# EAGLE design schema_8 (EAGLE 9.1.0)
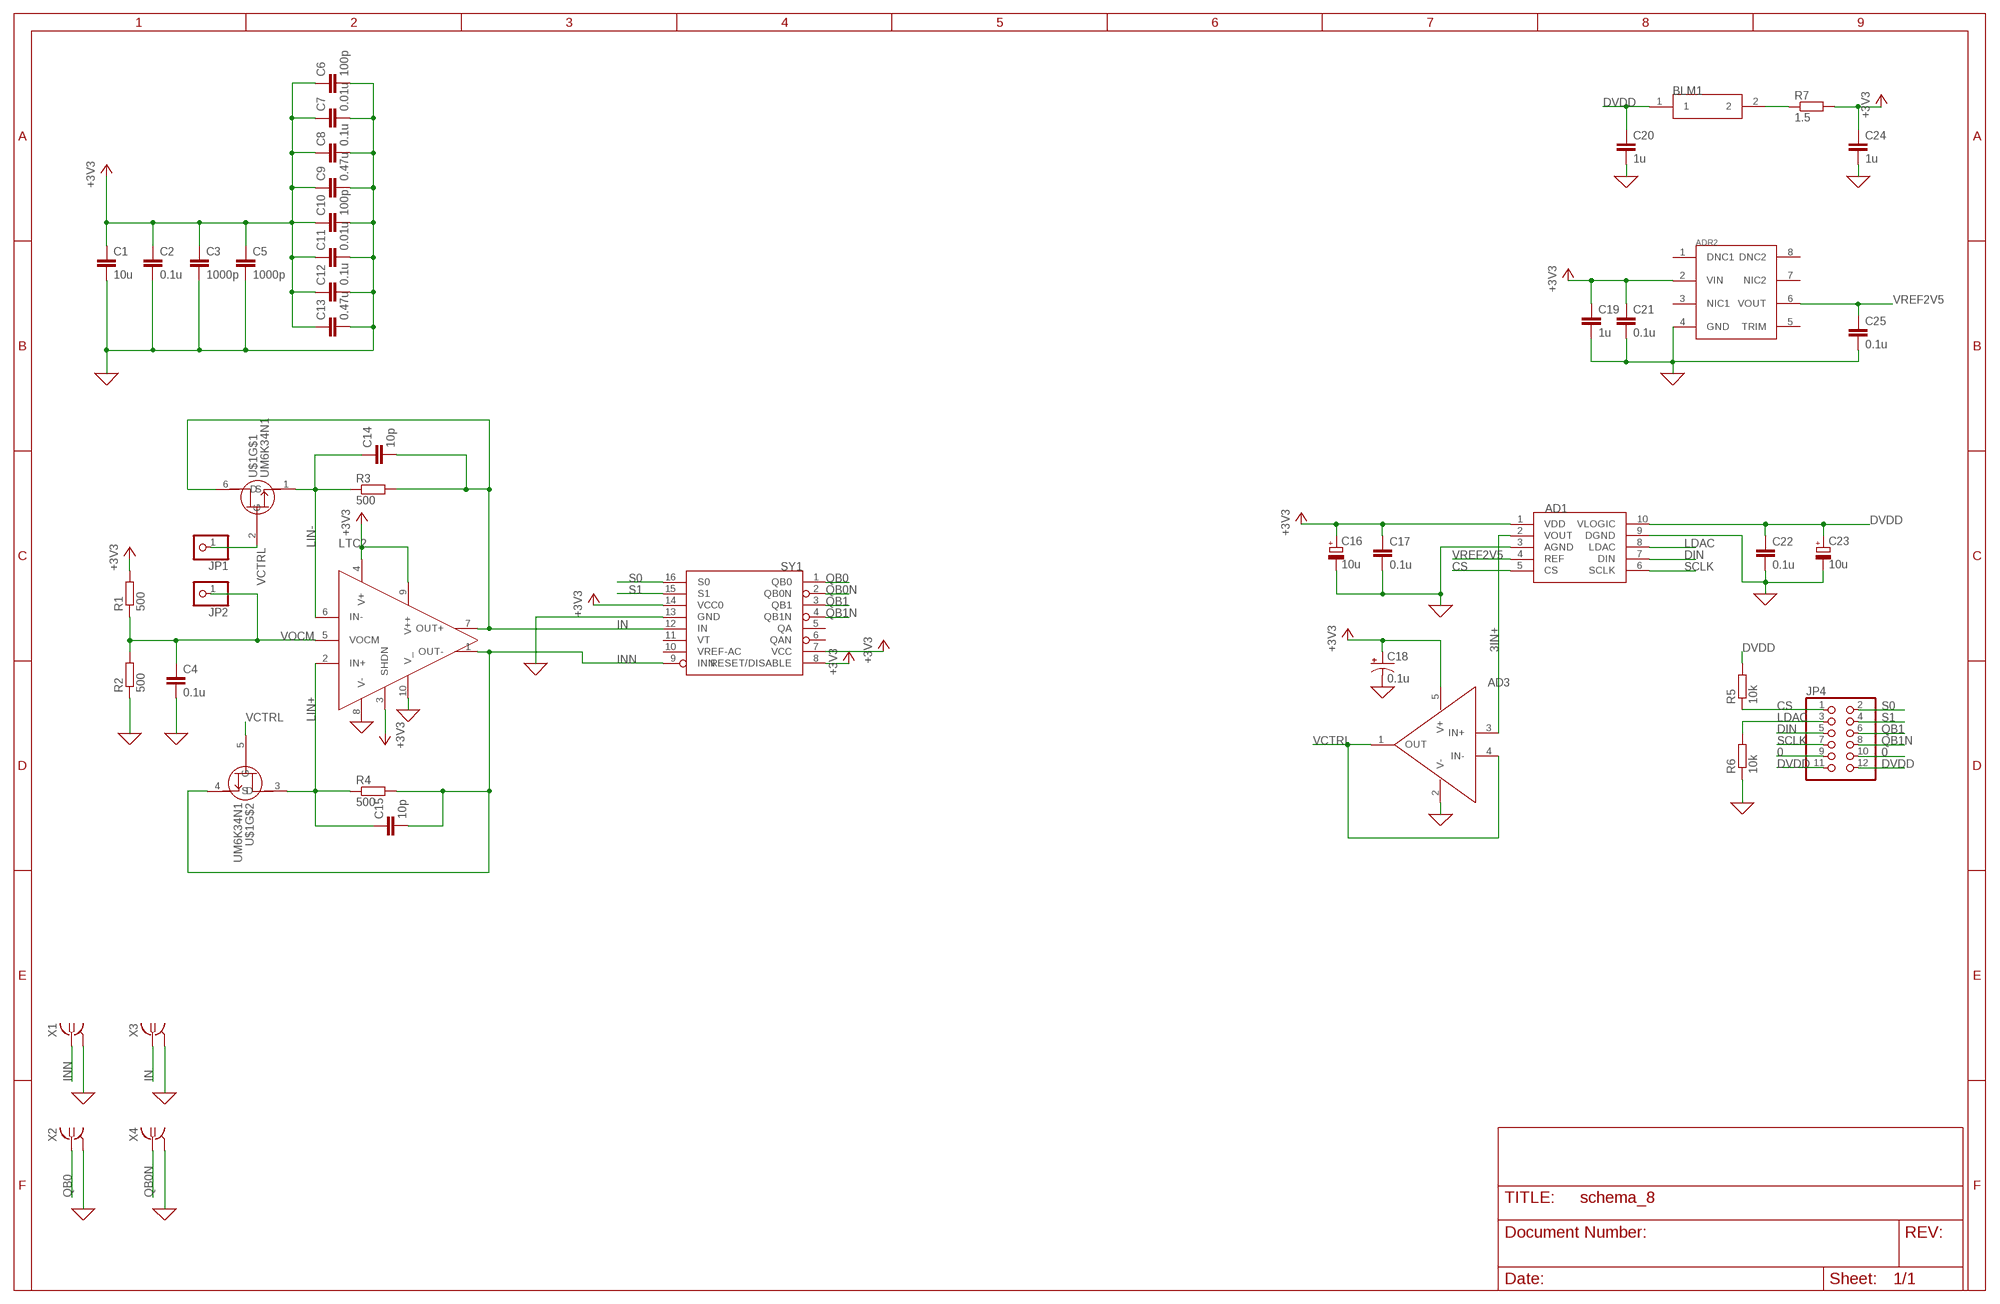
[diagram p0: schematic, sheet 1]

## Parts
AD1  0  AD5541AN  [SOP50P490X110-10]
AD3  0  AD8605N  [SOT95P280X145-5]
ADR2  ADR441N  [SOIC127P600X175-8]
BLM1  0  BLM18EG221TN1D  [C1608]
C1  10u  C-EUC1210  [C1210]
C2  0.1u  C-EUC0603  [C0603]
C3  1000p  C-EUC1206  [C1206]
C4  0.1u  C-EUC0603  [C0603]
C5  1000p  C-EUC1206  [C1206]
C6  100p  C-EUC0805  [C0805]
C7  0.01u  C-EUC1808  [C1808]
C8  0.1u  C-EUC0603  [C0603]
C9  0.47u  C-EUC1210  [C1210]
C10  100p  C-EUC0805  [C0805]
C11  0.01u  C-EUC1808  [C1808]
C12  0.1u  C-EUC0603  [C0603]
C13  0.47u  C-EUC1210  [C1210]
C14  10p  C-EUC0603  [C0603]
C15  10p  C-EUC0603  [C0603]
C16  10u  CPOL-EU153CLV-0405  [153CLV-0405]
C17  0.1u  C-EUC0603  [C0603]
C18  0.1u  CPOL-US153CLV-0405  [153CLV-0405]
C19  1u  C-EUC0603  [C0603]
C20  1u  C-EUC0603  [C0603]
C21  0.1u  C-EUC0603  [C0603]
C22  0.1u  C-EUC0603  [C0603]
C23  10u  CPOL-EU153CLV-0405  [153CLV-0405]
C24  1u  C-EUC0603  [C0603]
C25  0.1u  C-EUC0603  [C0603]
JP1  0  PINHD-1X1  [1X01]
JP2  0  PINHD-1X1  [1X01]
JP4  0  PINHD-2X6/90  [2X06/90]
LTC2  0  LTC6409N  [QFN50P350X250X80-10]
R1  500  R-EU_R0603  [R0603]
R2  500  R-EU_R0603  [R0603]
R3  500  R-EU_R0603  [R0603]
R4  500  R-EU_R0603  [R0603]
R5  10k  R-EU_R0805  [R0805]
R6  10k  R-EU_R0805  [R0805]
R7  1.5  R-EU_R0805  [R0805]
SY1  SY89873LN  [QFN50P300X300X90-16]
U$1  UM6K34N1  [SOTFL65P210X100-6]
X1  SMA-142-0701-871/880  [SMA-142-0701-871]
X2  SMA-142-0701-871/880  [SMA-142-0701-871]
X3  SMA-142-0701-871/880  [SMA-142-0701-871]
X4  SMA-142-0701-871/880  [SMA-142-0701-871]

## Nets
0: AD1.3(AGND) AD1.9(DGND) AD3.2(V-) ADR2.4(GND) C1.2 C2.2 C3.2 C4.2 C5.2 C6.2 C7.2 C8.2 C9.2 C10.2 C11.2 C12.2 C13.2 C16.- C17.2 C18.- C19.2 C20.2 C21.2 C22.2 C23.- C24.2 C25.2 JP4.9 JP4.10 LTC2.8(V-) LTC2.10(V_) R2.1 R6.1 SY1.13(GND) X1.2@1 X1.2@2 X1.2@3 X1.2@4 X2.2@1 X2.2@2 X2.2@3 X2.2@4 X3.2@1 X3.2@2 X3.2@3 X3.2@4 X4.2@1 X4.2@2 X4.2@3 X4.2@4 ; supply symbol labelled GND
3IN+: AD1.2(VOUT) AD3.3(IN+)
+3V3: AD1.1(VDD) AD3.5(V+) ADR2.2(VIN) C1.1 C2.1 C3.1 C5.1 C6.1 C7.1 C8.1 C9.1 C10.1 C11.1 C12.1 C13.1 C16.+ C17.1 C18.+ C19.1 C21.1 C24.1 LTC2.3(SHDN) LTC2.4(V+) LTC2.9(V++) R1.2 R7.2 SY1.7(VCC) SY1.8(RESET/DISABLE) SY1.14(VCC0)
CS: AD1.5(CS) JP4.1 R5.1
DIN: AD1.7(DIN) JP4.5
DVDD: AD1.10(VLOGIC) BLM1.1 C20.1 C22.1 C23.+ JP4.11 JP4.12 R5.2
IN: C14.2 LTC2.7(OUT+) R3.2 SY1.12(IN) U$1.6(D) X3.1
INN: C15.2 LTC2.1(OUT-) R4.2 SY1.9(INN) U$1.4(S) X1.1
LDAC: AD1.8(LDAC) JP4.3 R6.2
LIN+: C15.1 LTC2.2(IN+) R4.1 U$1.3(D)
LIN-: C14.1 LTC2.6(IN-) R3.1 U$1.1(S)
N$7: BLM1.2 R7.1
QB0: SY1.1(QB0) X2.1
QB0N: SY1.2(QB0N) X4.1
QB1: JP4.6 SY1.3(QB1)
QB1N: JP4.8 SY1.4(QB1N)
S0: JP4.2 SY1.16(S0)
S1: JP4.4 SY1.15(S1)
SCLK: AD1.6(SCLK) JP4.7
VCTRL: AD3.1(OUT) AD3.4(IN-) JP1.1 U$1.2(G) U$1.5(G)
VOCM: C4.1 JP2.1 LTC2.5(VOCM) R1.1 R2.2
VREF2V5: AD1.4(REF) ADR2.6(VOUT) C25.1
Unconnected: ADR2.1(DNC1) ADR2.3(NIC1) ADR2.5(TRIM) ADR2.7(NIC2) ADR2.8(DNC2) SY1.5(QA) SY1.6(QAN) SY1.10(VREF-AC) SY1.11(VT)

## Library data of the parts
AD1 = mylibrary:AD5541A
AD3 = mylibrary:AD8605
ADR2 = mylibrary:ADR441
BLM1 = mylibrary:BLM18EG221TN1D: https://www.tme.eu/en/details/blm18eg221tn1d/ferrite-beads/murata/
C1-C3 C5-C13 = rcl:C-EU: CAPACITOR, European symbol
C4 C14 C15 C17 C19-C22 C24 C25 = rcl:C-EU: CAPACITOR, European symbol; SPICEPREFIX: C
C16 C23 = resistor:CPOL-EU: POLARIZED CAPACITOR, European symbol
C18 = rcl:CPOL-US: POLARIZED CAPACITOR, American symbol; SPICEPREFIX: C
JP1 JP2 = pinhead:PINHD-1X1: PIN HEADER
JP4 = pinhead:PINHD-2X6: PIN HEADER
LTC2 = mylibrary:LTC6409
R1 R2 R5-R7 = rcl:R-EU_: RESISTOR, European symbol; SPICEPREFIX: R
R3 R4 = resistor:R-EU_: RESISTOR, European symbol
SY1 = mylibrary:SY89873L
U$1 = mylibrary:UM6K34N1
X1-X4 = con-coax:SMA-: SMA 50 Ohm End Launch Jack Receptacle - Round Contact Johnson Components Source: www.johnsoncomponents.com .. J502-ND.pdf; MF: JOHNSON COMPONENTS; MPN: 142-0701-871; OC_FARNELL: 1339835; OC_NEWARK: 91B6105

## Board
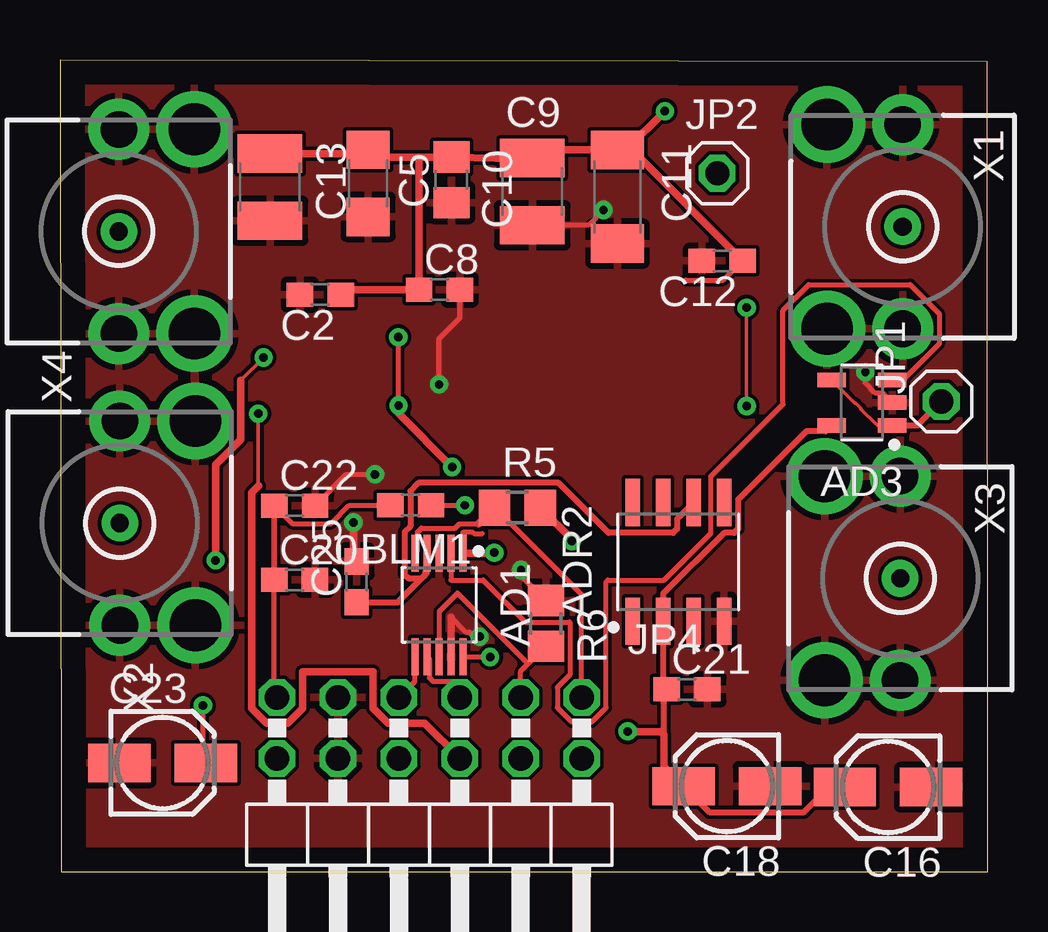
[diagram p1: board, top side]
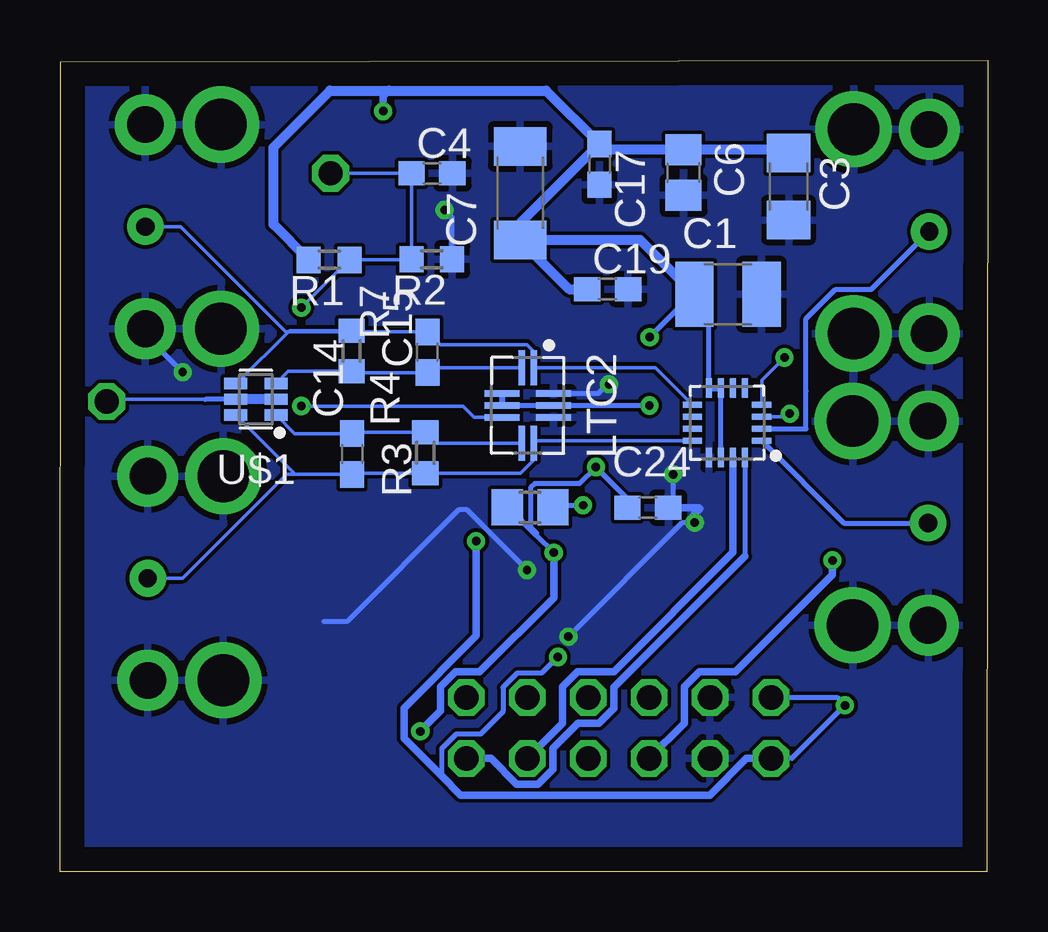
[diagram p2: board, bottom side, seen from below]

Size 38.69 x 33.83 mm. Coordinates in mm from the lower left corner, seen from the top.
Outline: 0.04,0 38.69,0 38.65,33.77 0,33.83 0.04,0
Copper layers (1*16): Top 0.035mm / dielectric 1.5mm / Bottom 0.035mm
Design rules "default": minimum track width 6mil, minimum drill 0.35mm, track to track 6mil, track to pad 6mil, pad to pad 6mil, via to via 6mil, smd to smd 6mil, copper to edge 40mil, drill to drill 6mil, minimum pad ring 10mil, minimum via ring 8mil, stop-mask expansion 4mil, vias tented up to drill 0mil, thermal gap 10mil

### Footprints (pad centres in the part's own frame; a part is rotated, then mirrored left to right if it is on the bottom)
SOP50P490X110-10 = smd 1.55 x 0.297: 1 -2.156,1; 2 -2.156,0.5; 3 -2.156,0; 4 -2.156,-0.5; 5 -2.156,-1; 6 2.156,-1; 7 2.156,-0.5; 8 2.156,0; 9 2.156,0.5; 10 2.156,1
SOT95P280X145-5 = smd 1.186 x 0.597: 1 -1.264,0.95; 2 -1.264,0; 3 -1.264,-0.95; 4 1.264,-0.95; 5 1.264,0.95
SOIC127P600X175-8 = smd 1.968 x 0.599: 1 -2.473,1.905; 2 -2.473,0.635; 3 -2.473,-0.635; 4 -2.473,-1.905; 5 2.473,-1.905; 6 2.473,-0.635; 7 2.473,0.635; 8 2.473,1.905
C1608 = smd 1.1 x 1: 1 -0.85,0; 2 0.85,0
C1210 = smd 1.6 x 2.7: 1 -1.4,0; 2 1.4,0
C0603 = smd 1.1 x 1: 1 -0.85,0; 2 0.85,0
C1206 = smd 1.6 x 1.8: 1 -1.4,0; 2 1.4,0
C0805 = smd 1.3 x 1.5: 1 -0.95,0; 2 0.95,0
C1808 = smd 1.6 x 2.2: 1 -1.95,0; 2 1.95,0
153CLV-0405 = smd 2.6 x 1.6: + 1.8,0; - -1.8,0
1X01 = drill 1.016 octagon: 1 0,0
2X06/90 = drill 1.016 octagon: 1 -6.35,-6.35; 2 -6.35,-3.81; 3 -3.81,-6.35; 4 -3.81,-3.81; 5 -1.27,-6.35; 6 -1.27,-3.81; 7 1.27,-6.35; 8 1.27,-3.81; 9 3.81,-6.35; 10 3.81,-3.81; 11 6.35,-6.35; 12 6.35,-3.81
QFN50P350X250X80-10 = smd 1.459 x 0.27: 1 -1.574,0.25; 2 -1.574,-0.25; 6 1.574,-0.25; 7 1.574,0.25 | smd 0.27 x 1.459: 3 -0.5,-1.074; 4 0,-1.074; 5 0.5,-1.074; 8 0.5,1.074; 9 0,1.074; 10 -0.5,1.074
R0603 = smd 1 x 1.1: 1 -0.85,0; 2 0.85,0
R0805 = smd 1.3 x 1.5: 1 -0.95,0; 2 0.95,0
QFN50P300X300X90-16 = smd 0.81 x 0.25: 1 -1.445,0.75; 2 -1.445,0.25; 3 -1.445,-0.25; 4 -1.445,-0.75; 9 1.445,-0.75; 10 1.445,-0.25; 11 1.445,0.25; 12 1.445,0.75 | smd 0.25 x 0.81: 5 -0.75,-1.445; 6 -0.25,-1.445; 7 0.25,-1.445; 8 0.75,-1.445; 13 0.75,1.445; 14 0.25,1.445; 15 -0.25,1.445; 16 -0.75,1.445
SOTFL65P210X100-6 = smd 0.956 x 0.472: 1 -0.836,0.65; 2 -0.836,0; 3 -0.836,-0.65; 4 0.836,-0.65; 5 0.836,0; 6 0.836,0.65
SMA-142-0701-871 = drill 0.762 pad 1.524: 1 0,0 | drill 1.524 pad 2.54: 2@1 -4.255,0; 2@2 4.255,0 | drill 2.159 pad 2.794: 2@3 -4.255,-3.15; 2@4 4.255,-3.15

### Placement (x,y rotation side)
AD1  15.8,11.13 270 top
AD3  33.43,19.55 180 top
ADR2  25.78,12.92 90 top
BLM1  14.62,15.28 0 top
C1  10.84,24.07 0 bottom
C2  10.85,24.06 180 top
C3  8.31,28.56 270 bottom
C4  23.18,29.1 0 bottom
C5  12.84,28.69 270 top
C6  12.7,29.14 270 bottom
C7  19.5,28.28 90 bottom
C8  15.82,24.27 0 top
C9  19.69,28.35 270 top
C10  16.31,28.84 270 top
C11  23.24,28.13 270 top
C12  27.61,25.46 180 top
C13  8.75,28.53 270 top
C14  26.5,17.41 270 bottom
C15  23.36,21.65 90 bottom
C16  34.52,3.53 180 top
C17  16.2,29.48 270 bottom
C18  27.8,3.57 180 top
C19  15.86,24.29 0 bottom
C20  9.78,12.17 0 top
C21  26.14,7.6 0 top
C22  9.79,15.27 0 top
C23  4.28,4.55 0 top
C24  14.18,15.18 0 bottom
C25  12.37,12.09 90 top
JP1  36.74,19.6 270 top
JP2  27.4,29.11 0 top
JP4  15.4,0.92 180 top
LTC2  19.19,19.44 270 bottom
R1  27.46,25.5 180 bottom
R2  23.18,25.53 180 bottom
R3  23.46,17.46 270 bottom
R4  26.53,21.71 90 bottom
R5  19.07,15.18 0 top
R6  20.25,10.36 270 top
R7  19.09,15.19 180 bottom
SY1  10.88,18.71 180 bottom
U$1  30.52,19.69 180 bottom
X1  35.13,26.88 270 top
X2  2.49,14.53 90 top
X3  35.03,12.24 270 top
X4  2.45,26.69 90 top

### Tracks (layer width: path | path; a pad name or v marks a point on that pad's centre or on a via)
0  (via drill 0.35)
  Top 0.2: R6.1 19.22,12.34 v19.22,12.58 | v15.8,20.32 15.8,22.21 16.67,23.08 C8.2 | 16.3,10.6 16.91,10 17.05,10 17.25,9.8 v17.49,9.8 | C22.2 11.93,16.56 v13.13,16.56 | AD3.2 34.3,19.95 34,19.95 33.57,20.38 v33.57,20.82 | v22.66,27.58 22.02,26.95 C9.2
  Top 0.305: AD1.9 16.3,10.6 | v12.23,14.56 12.23,13.08 C25.2
  Bottom 0.2: v19.22,12.58 21.72,15.08 22.07,15.08 26.72,10.43 27.69,10.43 | LTC2.10 16.25,19.94 15.87,20.32 v15.8,20.32 | v17.49,9.8 12.74,14.56 v12.23,14.56 | v13.13,16.56 13.13,15.38 C24.2 | v33.57,20.82 35.13,22.38 X1.2@2 | R2.1 22.33,27.26 v22.66,27.58
  Bottom 0.305: C24.2 12.05,15.18 12.01,15.14 12.23,14.92 v12.23,14.56
  pour Top: 0.38,33.57 38.35,33.57 38.42,33.64 38.42,0.4 38.33,0.31 0.46,0.31 0.36,0.41 0.36,33.57 0.36,33.57
  pour Bottom: 0.42,33.62 38.47,33.62 38.52,33.57 38.52,0.19 38.53,0.19 0.18,0.19 0.18,33.62 0.23,33.66
3IN+
  Top 0.2: AD1.2 16.3,12.16 17.64,12.16 19.4,10.4 21.25,10.4 21.25,8.21 20.73,7.69 20.73,6.85 21.33,6.25 22.17,6.25 22.76,6.85 22.76,12.08 22.84,12.16 25.19,12.16 27.13,14.1 27.13,16.48 30.14,19.48 30.14,23.39 31.21,24.47 35.44,24.47 36.65,23.26 36.65,22 35.15,20.5 AD3.3
+3V3  (via drill 0.35)
  Top 0.2: v14.12,19.44 14.12,22.17 14.11,22.18 v14.11,22.28 | AD1.1 16.8,14.15 17.22,14.15 17.27,14.1 17.61,14.1 | 26.08,24.66 27.65,24.66 C12.1
  Top 0.254: 25.19,7.7 25.14,7.75 ADR2.2 25.14,11.58 27.69,14.13 28.1,14.13 28.26,14.29 28.26,15.52 31.1,18.36 31.92,18.36 AD3.5 | 25.19,7.7 C21.1 | 25.19,5.71 25.19,7.7 | C16.+ 32.06,3.53 31.01,2.49 27.08,2.49 C18.+
  Top 0.305: C13.1 12.68,29.93 C5.1 13.15,29.79 14.84,29.79 | 14.84,29.79 C10.1 18.17,29.75 C9.1 20.02,30.08 C11.1 23.6,30.08 | 14.84,29.79 14.97,29.66 C8.1 11.91,24.27 C2.1 | 23.6,30.08 23.84,30.08 C12.1 28.24,25.46 | C18.+ 25.19,4.38 25.19,5.71 25.05,5.85 v23.68,5.85 v23.67,5.85 | v25.21,31.7 23.6,30.08 | AD1.1 18.05,13.28 18.09,13.32 v18.1,13.3 | v16.35,16.87 14.12,19.1 v14.12,19.44
  Bottom 0.2: SY1.8 11.63,23.46 C1.1 12.32,24.07 v14.11,22.28 | SY1.14 SY1.7 | LTC2.4 LTC2.9 v14.12,19.44 14.11,19.45 | C24.1 15.03,15.55 v16.35,16.87 17.03,16.19 18.89,16.19 19.04,16.04 19.04,14.33 18.82,14.11 18.82,14.02 | v18.1,13.3 18.82,14.02 | 18.82,14.02 19.99,15.19 R7.2
  Bottom 0.254: SY1.8 SY1.7 | LTC2.3 LTC2.4
  Bottom 0.305: v18.1,13.3 18.1,11.42 21.19,8.34 22.19,8.34 22.81,7.71 22.81,6.71 v23.67,5.85 | 24.98,32.55 25.21,32.32 v25.21,31.7 25.21,31.68
  Bottom 0.406: C3.1 8.44,30.09 C6.1 15.96,30.09 C17.1 | C17.1 19.5,27.03 C7.1 | C7.1 17.46,24.29 C19.1 | C1.1 14.5,26.33 C7.1 | R1.2 29.79,26.98 29.79,30.19 27.43,32.55 24.98,32.55 18.42,32.55 C17.1
CS
  Top 0.2: R5.1 18.8,14.5 21.09,12.21 21.11,12.21 21.75,11.57 JP4.1 | AD1.5 14.9,13.38 14.9,14.16 15.07,14.33 16.47,14.33 16.65,14.5 17.44,14.5
  Top 0.305: 17.44,14.5 R5.1
DIN
  Top 0.2: JP4.5 16.67,7.6 16.33,7.94 15.55,7.94 15.4,8.09 15.4,8.87 AD1.7
DVDD  (via drill 0.35)
  Top 0.2: 8.94,15.03 C22.1 9.69,14.51 11.29,14.51 12.05,15.28 BLM1.1 | 8.94,15.03 C20.1 | JP4.11 8.94,7.38 8.94,15.03 | C23.+ 5.96,4.66 v5.96,6.94 | AD1.10 17.95,8.97 17.97,8.95 17.94,8.95 v17.93,8.96
  Top 0.305: R5.2 21.41,13.79 21.41,13.78 v21.34,13.78
  Bottom 0.2: JP4.12 8.17,4.73 v5.96,6.94 6.29,7.27 JP4.11 | v17.93,8.96 18.61,8.28 19.63,8.28 20.22,7.69 20.22,6.67 21.15,5.74 22.17,5.74 22.78,5.13 22.78,4
  Bottom 0.305: JP4.12 10.08,4.73 11.6,3.2 21.98,3.2 22.78,4 24.35,5.57 24.35,6.82 21.34,9.83 v21.34,13.78
IN
  Bottom 0.152: SY1.12 18.84,17.96 LTC2.7 18.94,17.18 19.5,16.61 R3.2 26.45,16.61 C14.2 28.88,16.56 | X3.1 33.56,12.24 29.24,16.56 28.88,16.56 | 28.88,16.56 U$1.6
INN
  Bottom 0.152: SY1.9 13.87,21.01 LTC2.1 18.94,21.7 19.21,21.97 22.82,21.97 C15.2 26.48,22.5 | X1.1 33.66,26.88 29.28,22.5 26.48,22.5 | 26.48,22.5 R4.2 28.89,22.56 29.12,22.56 31.33,20.34 U$1.4
LDAC
  Top 0.2: JP4.3 19.21,8.36 19.52,8.67 | R6.2 19.54,8.69 19.52,8.67 | AD1.8 15.8,10.85 16.57,11.62 19.52,8.67
LIN+
  Bottom 0.152: LTC2.2 23.15,21.01 C15.1 26.48,20.8 R4.1 29.17,20.86 U$1.3
LIN-
  Bottom 0.152: LTC2.6 23.01,17.86 R3.1 26.45,18.31 C14.1 28.9,18.26 U$1.1
N$7  (via drill 0.35)
  Top 0.2: BLM1.2 v16.88,15.28
  Bottom 0.2: R7.1 18.05,15.28 v16.88,15.28 | v16.88,15.28 v16.87,15.29 v16.88,15.28
QB0
  Bottom 0.2: SY1.1 6,14.53 X2.1
QB0N
  Bottom 0.2: SY1.2 7.59,18.46 7.59,20.04 7.59,23.04 6.36,24.27 4.87,24.27 X4.1
QB1  (via drill 0.35)
  Top 0.152: v8.27,19.1 8.27,16.12 8.29,16.1
  Top 0.305: JP4.6 15.19,6.2 13.69,6.2 13.06,6.83 13.06,8.34 10.11,8.34 10.11,6.83 9.49,6.2 8.61,6.2 7.98,6.83 7.98,15.79 8.29,16.1
  Bottom 0.152: SY1.3 8.39,18.97 v8.27,19.1
QB1N  (via drill 0.35)
  Top 0.152: v8.48,21.43 7.54,20.49
  Top 0.305: 7.54,20.49 7.54,18 6.5,16.97 6.5,13 v6.48,12.98
  Bottom 0.152: SY1.4 9.43,20.48 v8.48,21.43
  Bottom 0.305: v6.48,12.98 6.48,12.37 10.52,8.34 12.03,8.34 12.65,7.71 12.65,6.2 JP4.8
S0
  Bottom 0.2: SY1.16 10.13,13.16
  Bottom 0.305: 10.13,13.16 15.6,7.69 15.6,6.83 16.23,6.2 17.09,6.2 18.14,5.15 18.14,4.29 18.77,3.66 19.65,3.66 20.72,4.73 JP4.2
S1
  Bottom 0.305: SY1.15 10.63,13.31 15.6,8.34 17.11,8.34 17.73,7.71 17.73,6.2 JP4.4
SCLK
  Top 0.2: AD1.6 14.8,7.94 JP4.7
VCTRL
  Top 0.152: AD3.1 34.07,18.6 33.39,19.28 33.39,19.33 33.18,19.54 33.13,19.54 AD3.4
  Top 0.254: AD3.1 35.74,18.6 JP1.1
  Bottom 0.152: 32.62,19.69 36.65,19.69
  Bottom 0.2: U$1.5 32.62,19.69
  Bottom 0.406: U$1.2 U$1.5 | 36.65,19.69 JP1.1
VOCM  (via drill 0.35)
  Top 0.152: v28.62,19.41 v28.62,23.51
  Bottom 0.152: LTC2.5 21.42,18.94 21.89,19.4 28.62,19.4 v28.62,19.41 | v28.62,23.51 26.63,25.5 R1.1 24.06,25.5 R2.2 C4.1 27.39,29.1 JP2.1
VREF2V5
  Top 0.254: AD1.4 15.3,12.58 | 15.3,12.58 15.3,12.46 14.07,11.24 C25.1 | ADR2.6 25.72,14.7 25.72,14.29 25.56,14.13 22.87,14.13 20.78,16.21 14.95,16.21 14.61,15.87 14.61,14.4 14.37,14.17 14.37,12.39 14.54,12.23 15.07,12.23 15.23,12.39 15.23,12.51 15.3,12.58